# Altium schematic sheet Sheet2 - Moteur.SchDoc
size A4
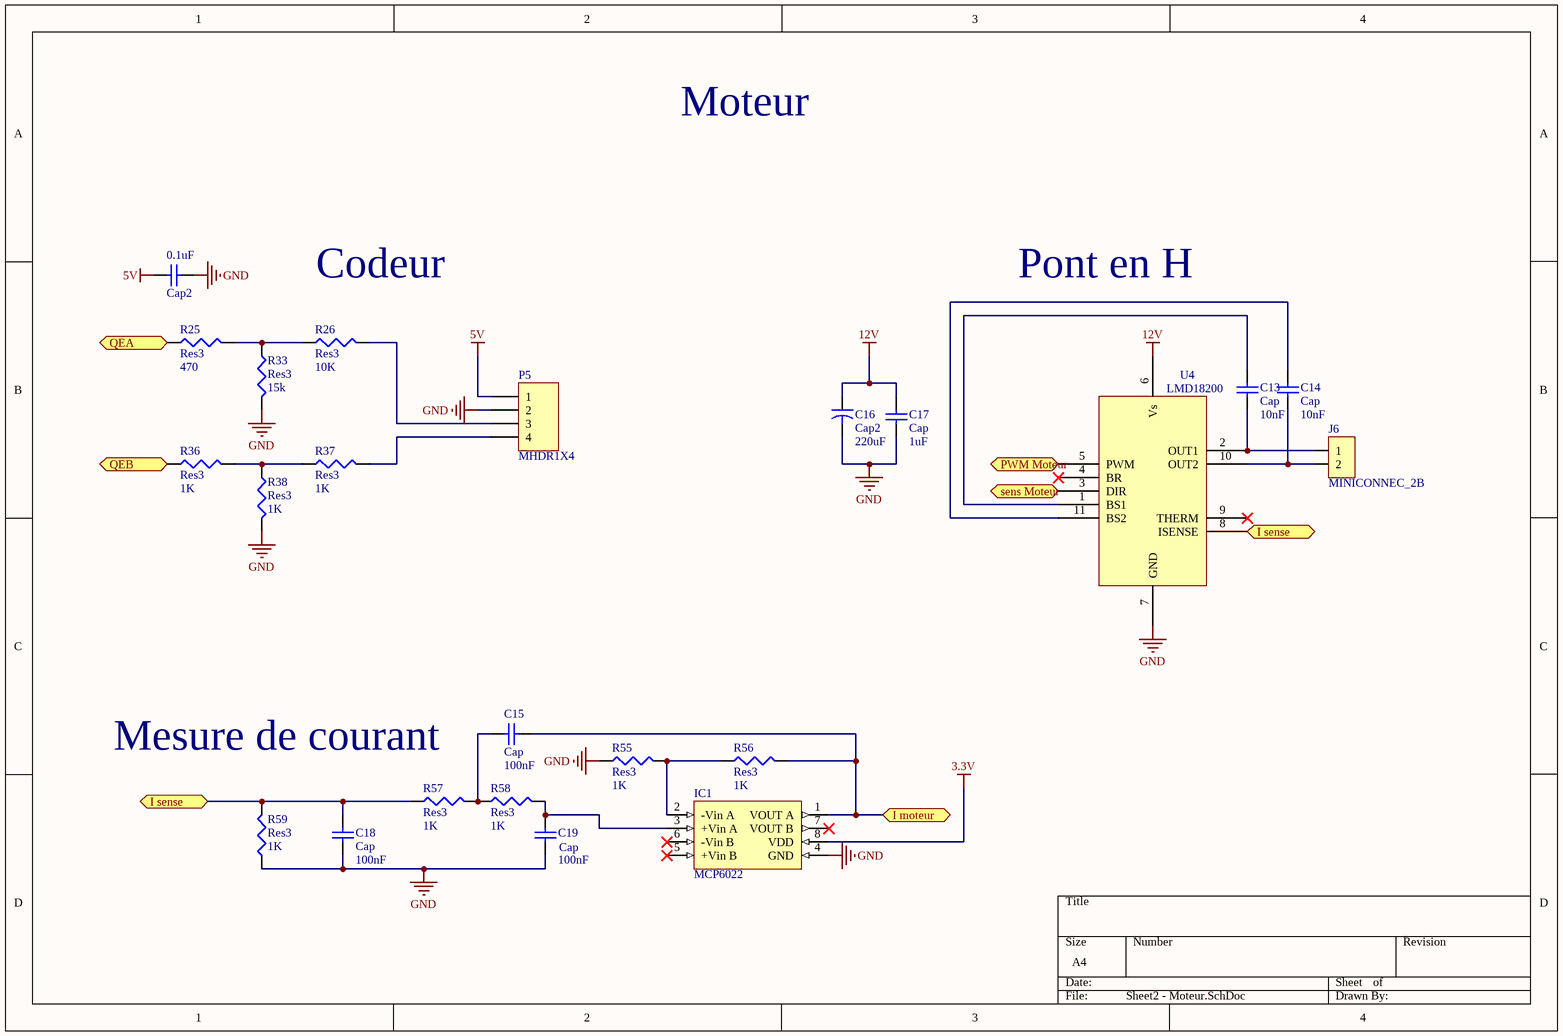
[diagram p0: Sheet2 - Moteur.SchDoc]

## Parts
0.1uF  Cap2  [RAD-0.3]
C13  Cap  value 10nF  [RAD-0.3]
C14  Cap  value 10nF  [RAD-0.3]
C15  Cap  value 100nF  [RAD-0.3]
C16  Cap2  value 220uF  [CAPR5-4X5]
C17  Cap  value 1uF  [RAD-0.3]
C18  Cap  value 100nF  [RAD-0.3]
C19  Cap  value 100nF  [RAD-0.3]
IC1  MCP6022  [SOIC 4B]
J6  MINICONNEC_2B  [MINICONNEC_C]
P5  MHDR1X4  [MHDR1X4]
R25  Res3  value 470  [RESC1608L]
R26  Res3  value 10K  [RESC1608L]
R33  Res3  value 15k  [RESC1608L]
R36  Res3  value 1K  [RESC1608L]
R37  Res3  value 1K  [RESC1608L]
R38  Res3  value 1K  [RESC1608L]
R55  Res3  value 1K  [RESC1608L]
R56  Res3  value 1K  [RESC1608L]
R57  Res3  value 1K  [RESC1608L]
R58  Res3  value 1K  [RESC1608L]
R59  Res3  value 1K  [RESC1608L]
U4  LMD18200  [TA11B]  (value not drawn)

## Ports
I moteur (bidir), I sense, PWM Moteur (bidir), QEA (bidir), QEB (bidir), sens Moteur (bidir)

## Nets
3.3V: IC1.8(VDD)
5V: 0.1uF.2 P5.1
12V: C16.1 C17.2 U4.6(Vs)
GND: 0.1uF.1 C16.2 C17.1 C18.1 C19.1 IC1.4(GND) P5.2 R33.2 R38.2 R55.1 R59.1 U4.7(GND)
I moteur: C15.1 IC1.1(VOUT_A) R56.2 ; port I moteur
I sense: C18.2 R57.1 R59.2 U4.8(ISENSE) ; port I sense
PWM Moteur: U4.5(PWM) ; port PWM Moteur
QEA: R25.1 ; port QEA
QEB: R36.1 ; port QEB
sens Moteur: U4.3(DIR) ; port sens Moteur
NetC13_1: C13.1 U4.1(BS1)
NetC13_2: C13.2 J6.1 U4.2(OUT1)
NetC14_1: C14.1 U4.11(BS2)
NetC14_2: C14.2 J6.2 U4.10(OUT2)
NetC15_2: C15.2 R57.2 R58.1
NetC19_2: C19.2 IC1.3(+Vin_A) R58.2
NetIC1_2: IC1.2(-Vin_A) R55.2 R56.1
NetP5_3: P5.3 R26.2
NetP5_4: P5.4 R37.2
NetR25_2: R25.2 R26.1 R33.1
NetR36_2: R36.2 R37.1 R38.1

Not connected (* = marked no-connect by the designer): IC1 5(+Vin_B)* 6(-Vin_B)* 7(VOUT_B)*; U4 4(BR)* 9(THERM)*

## Notes on the sheet
- Moteur
- Codeur
- Pont en H
- (near C15) Mesure de courant

## Library data of the parts
0.1uF C13-C15 C17-C19 = Cap: Capacitor; Published: 8-Jun-2000; LatestRevisionDate: 17-Jul-2002; LatestRevisionNote: Re-released for DXP Platform.; PackageReference: RAD-0.3; Publisher: Altium Limited
C16 = Cap2: Capacitor; Published: 23-Sep-2002; PackageReference: CAPR5-4X5; Publisher: Altium Limited
IC1 = MCP6022: AOP Microchip
J6 = MINICONNEC_2B: Connecteur
P5 = MHDR1X4: Header, 4-Pin; LatestRevisionDate: 17-Jul-2002; LatestRevisionNote: Re-released for DXP Platform.; Publisher: Altium Limited
R25 R26 R33 R36-R38 R55-R59 = Res3: Resistor; Published: 8-Jun-2000; LatestRevisionDate: 29-May-2009; LatestRevisionNote: IPC-7351 Footprint Added.; PackageReference: J1-0603; Publisher: Altium Limited; PackageDescription: Chip Resistor
U4 = LMD18200: Pont-H